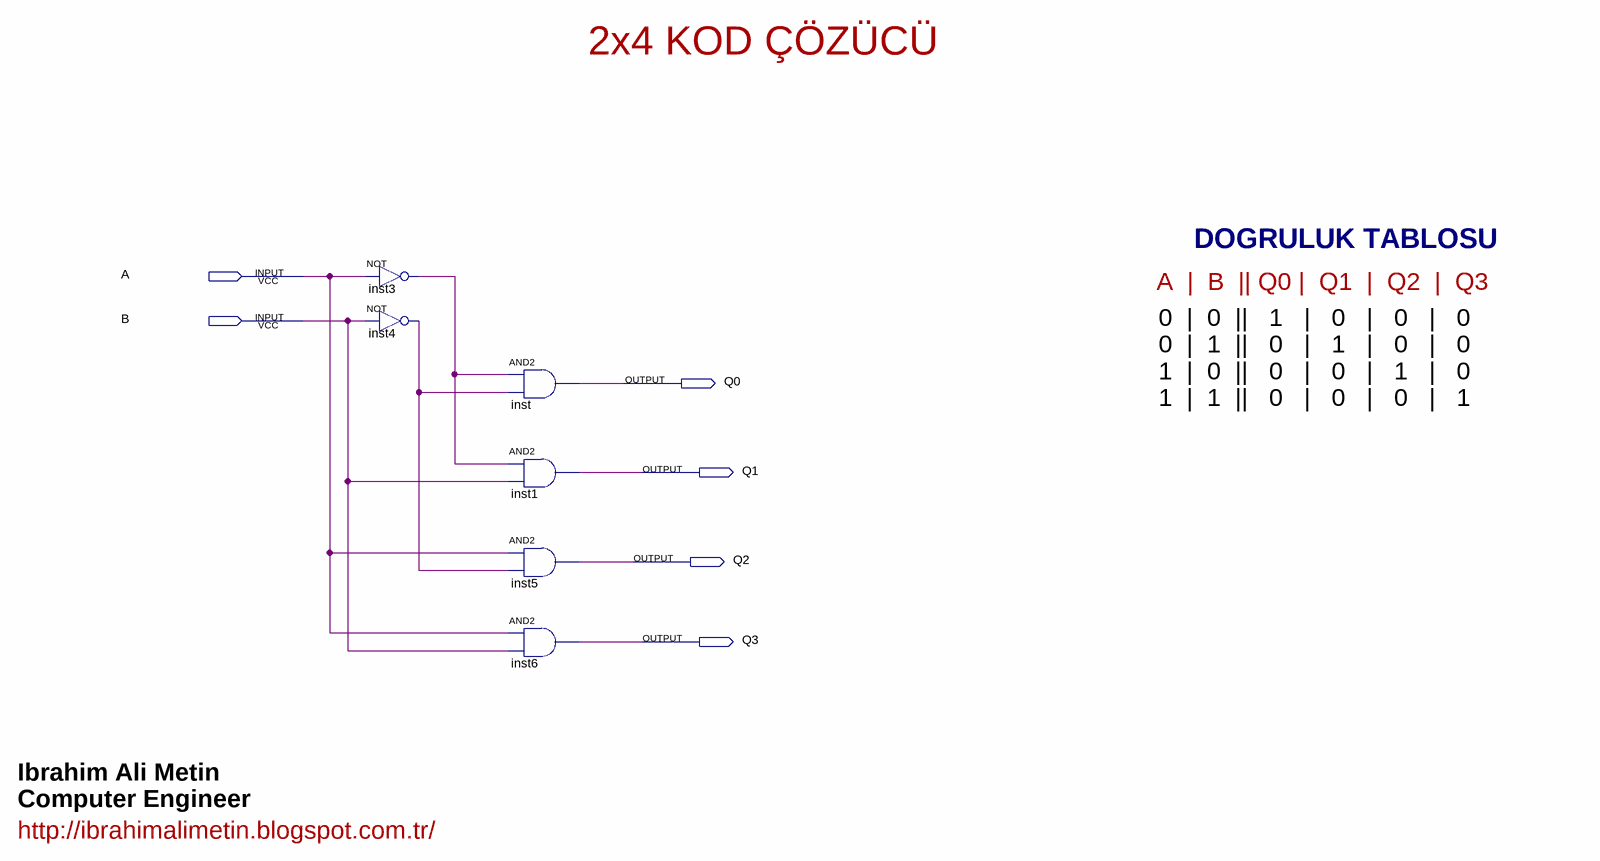
[diagram p0: schematic sheet]
// Quartus schematic kodcozucu.bdf as structural Verilog: 6 symbols, 6 pins
module kodcozucu (
  input  A,
  input  B,
  output Q0,
  output Q1,
  output Q2,
  output Q3
);

  wire inst3_out, inst4_out;

  not inst3 (inst3_out, A);
  not inst4 (inst4_out, B);
  and inst (Q0, inst3_out, inst4_out);
  and inst1 (Q1, inst3_out, B);
  and inst5 (Q2, A, inst4_out);
  and inst6 (Q3, A, B);

  // Notes on the sheet:
  //   2x4 KOD ÇÖZÜCÜ
  //   DOGRULUK TABLOSU
  //    A  |  B  || Q0 |  Q1  |  Q2  |  Q3
  //   0  |  0  ||   1   |   0   |   0   |   0
  //   0  |  1  ||   0   |   1   |   0   |   0
  //   1  |  0  ||   0   |   0   |   1   |   0
  //   1  |  1  ||   0   |   0   |   0   |   1
  //   Ibrahim Ali Metin
  //   Computer Engineer
  //   http://ibrahimalimetin.blogspot.com.tr/
endmodule
